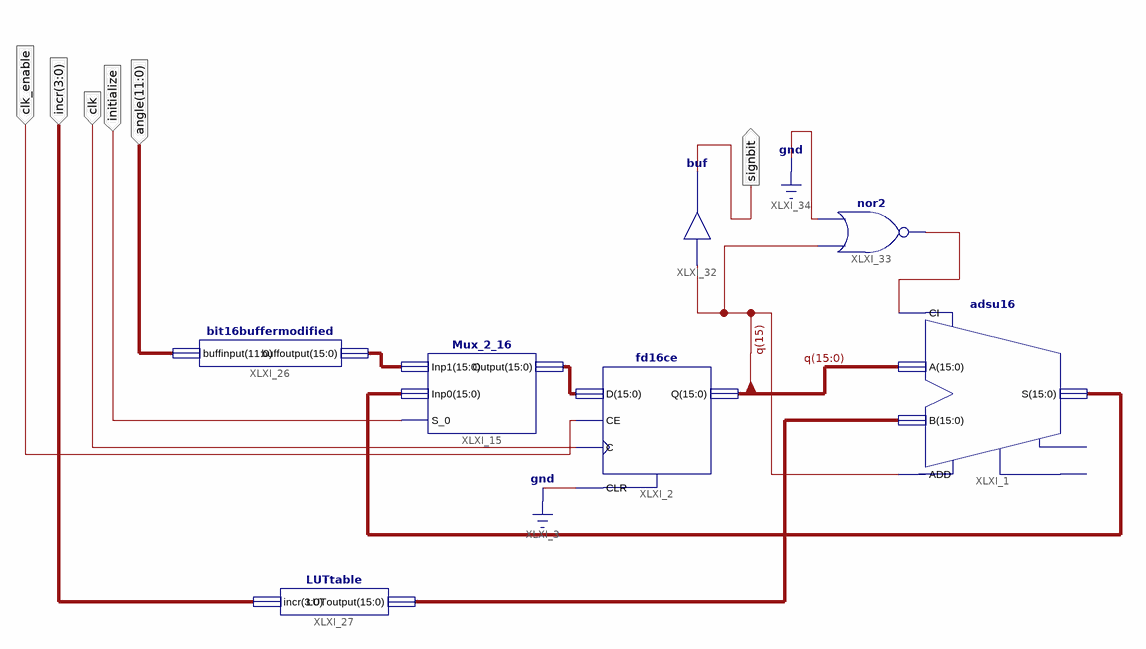
[diagram p0: schematic sheet 1]
// Xilinx ISE schematic Z_register.sch (spartan3) as structural Verilog: 7 symbols, 6 ports
module Z_register (
  input  clk,
  input  initialize,
  input  [11:0] angle,
  input  [3:0] incr,
  input  clk_enable,
  output signbit
);

  wire XLXN_133;
  wire [15:0] q, XLXN_70, XLXN_111, XLXN_128, XLXN_130;

  adsu16 XLXI_1 (.A(q), .ADD(q[15]), .B(XLXN_111), .CI(XLXN_133), .S(XLXN_130));  // open: CO, OFL
  fd16ce XLXI_2 (.C(clk), .CE(clk_enable), .CLR(1'b0), .D(XLXN_70), .Q(q));
  Mux_2_16 XLXI_15 (.Inp1(XLXN_128), .Inp0(XLXN_130), .S_0(initialize), .Output(XLXN_70));
  bit16buffermodified XLXI_26 (.buffinput(angle), .buffoutput(XLXN_128));
  LUTtable XLXI_27 (.incr(incr), .LUToutput(XLXN_111));
  buf XLXI_32 (signbit, q[15]);
  nor XLXI_33 (XLXN_133, q[15], 1'b0);
endmodule
